# EAGLE design ESClogic2 (EAGLE 5.11)
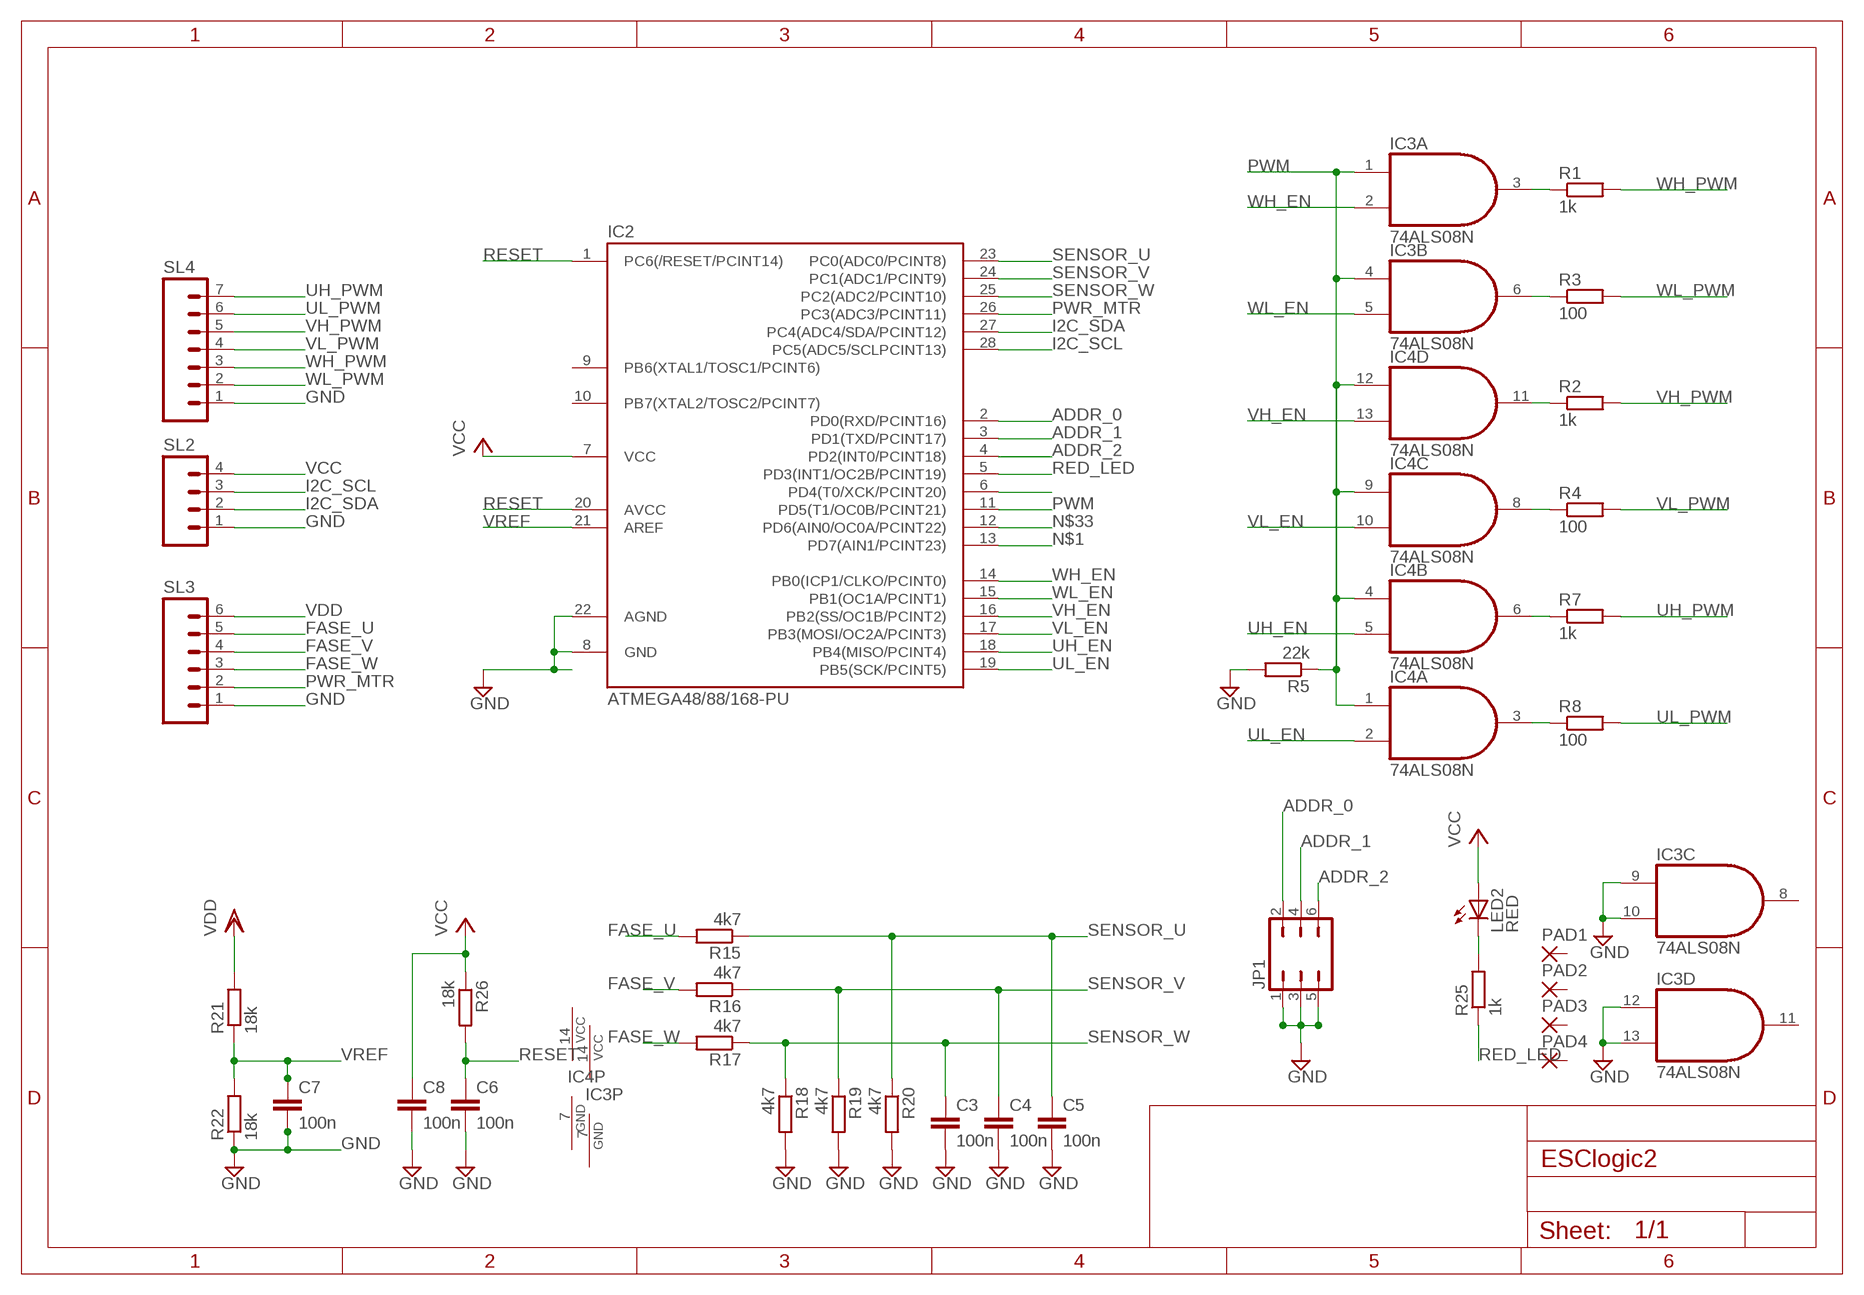
[diagram p0: schematic, sheet 1]

## Parts
C3  100n  C-EU050-025X075  [C050-025X075]
C4  100n  C-EU050-025X075  [C050-025X075]
C5  100n  C-EU050-025X075  [C050-025X075]
C6  100n  C-EU050-025X075  [C050-025X075]
C7  100n  C-EU050-025X075  [C050-025X075]
C8  100n  C-EU075-032X103  [C075-032X103]
IC2  ATMEGA48/88/168-PU  [DIL28-3]
IC3  74ALS08N  [DIL14]
IC4  74ALS08N  [DIL14]
JP1  JP3Q  [JP3Q]
LED2  RED  LED3MM  [LED3MM]
PAD1  2,54/1,0  [2,54/1,0]
PAD2  2,54/1,0  [2,54/1,0]
PAD3  2,54/1,0  [2,54/1,0]
PAD4  2,54/1,0  [2,54/1,0]
R1  1k  R-EU_0207/7  [0207/7]
R2  1k  R-EU_0207/7  [0207/7]
R3  100  R-EU_0207/7  [0207/7]
R4  100  R-EU_0207/7  [0207/7]
R5  22k  R-EU_0207/7  [0207/7]
R7  1k  R-EU_0207/7  [0207/7]
R8  100  R-EU_0207/7  [0207/7]
R15  4k7  R-EU_0207/7  [0207/7]
R16  4k7  R-EU_0207/7  [0207/7]
R17  4k7  R-EU_0207/7  [0207/7]
R18  4k7  R-EU_0207/7  [0207/7]
R19  4k7  R-EU_0207/7  [0207/7]
R20  4k7  R-EU_0207/7  [0207/7]
R21  18k  R-EU_0207/7  [0207/7]
R22  18k  R-EU_0207/7  [0207/7]
R25  1k  R-EU_0207/7  [0207/7]
R26  18k  R-EU_0207/7  [0207/7]
SL2  M04  [04P]
SL3  M06  [06P]
SL4  M07  [07P]

## Nets
ADDR_0: IC2.2(PD0(RXD/PCINT16)) JP1.2
ADDR_1: IC2.3(PD1(TXD/PCINT17)) JP1.4
ADDR_2: IC2.4(PD2(INT0/PCINT18)) JP1.6
FASE_U: R15.2 SL3.5
FASE_V: R16.2 SL3.4
FASE_W: R17.2 SL3.3
GND: C3.2 C4.2 C5.2 C6.2 C7.2 C8.2 IC2.8(GND) IC2.22(AGND) IC3.9(C:I0) IC3.10(C:I1) IC3.12(D:I0) IC3.13(D:I1) JP1.1 JP1.3 JP1.5 R5.2 R18.2 R19.2 R20.2 R22.1 SL2.1 SL3.1 SL4.1
I2C_SCL: IC2.28(PC5(ADC5/SCLPCINT13)) SL2.3
I2C_SDA: IC2.27(PC4(ADC4/SDA/PCINT12)) SL2.2
N$1: IC2.13(PD7(AIN1/PCINT23))
N$8: LED2.K(C) R25.2
N$12: IC3.3(A:O) R1.1
N$14: IC3.6(B:O) R3.1
N$15: IC4.11(D:O) R2.1
N$16: IC4.8(C:O) R4.1
N$17: IC4.6(B:O) R7.1
N$18: IC4.3(A:O) R8.1
N$31: IC2.6(PD4(T0/XCK/PCINT20))
N$33: IC2.12(PD6(AIN0/OC0A/PCINT22))
PWM: IC2.11(PD5(T1/OC0B/PCINT21)) IC3.1(A:I0) IC3.4(B:I0) IC4.1(A:I0) IC4.4(B:I0) IC4.9(C:I0) IC4.12(D:I0) R5.1
PWR_MTR: IC2.26(PC3(ADC3/PCINT11)) SL3.2
RED_LED: IC2.5(PD3(INT1/OC2B/PCINT19)) R25.1
RESET: C6.1 IC2.1(PC6(/RESET/PCINT14)) IC2.20(AVCC) R26.2
SENSOR_U: C5.1 IC2.23(PC0(ADC0/PCINT8)) R15.1 R20.1
SENSOR_V: C4.1 IC2.24(PC1(ADC1/PCINT9)) R16.1 R19.1
SENSOR_W: C3.1 IC2.25(PC2(ADC2/PCINT10)) R17.1 R18.1
UH_EN: IC2.18(PB4(MISO/PCINT4)) IC4.5(B:I1)
UH_PWM: R7.2 SL4.7
UL_EN: IC2.19(PB5(SCK/PCINT5)) IC4.2(A:I1)
UL_PWM: R8.2 SL4.6
VCC: C8.1 IC2.7(VCC) LED2.A R26.1 SL2.4
VDD: R21.2 SL3.6
VH_EN: IC2.16(PB2(SS/OC1B/PCINT2)) IC4.13(D:I1)
VH_PWM: R2.2 SL4.5
VL_EN: IC2.17(PB3(MOSI/OC2A/PCINT3)) IC4.10(C:I1)
VL_PWM: R4.2 SL4.4
VREF: C7.1 IC2.21(AREF) R21.1 R22.2
WH_EN: IC2.14(PB0(ICP1/CLKO/PCINT0)) IC3.2(A:I1)
WH_PWM: R1.2 SL4.3
WL_EN: IC2.15(PB1(OC1A/PCINT1)) IC3.5(B:I1)
WL_PWM: R3.2 SL4.2
Unconnected: IC2.9(PB6(XTAL1/TOSC1/PCINT6)) IC2.10(PB7(XTAL2/TOSC2/PCINT7)) IC3.8(C:O) IC3.11(D:O) PAD1.1(P) PAD2.1(P) PAD3.1(P) PAD4.1(P)

## Power pins joined to a net without a drawn wire
GND: IC3.7(P:GND) IC4.7(P:GND)
VCC: IC3.14(P:VCC) IC4.14(P:VCC)

## Library data of the parts
C3-C8 = rcl:C-EU: CAPACITOR, European symbol
IC2 = atmega8:ATMEGA48/88/168-PU
IC3 IC4 = 74xx-us:74*08: Quad 2-input AND gate
JP1 = jumper:JP3Q: JUMPER
LED2 = led:LED: LED OSRAM: - CHIPLED LG R971, LG N971, LY N971, LG Q971, LY Q971, LO R971, LY R971 LH N974, LH R974 LS Q976, LO Q976, LY Q976 LO Q996 - Hyper CHIPLED LW Q18S LB Q993, LB Q99A, LB R99A - SideLED LS A670, LO A670, LY A670, LG A670, LP A670 LB A673, LV A673, LT A673, LW A673 LH A674 LY A675 LS A676, LA A676, LO A676, LY A676, LW A676 LS A679, LY A679, LG A679 - Hyper Micro SIDELED® LS Y876, LA Y876, LO Y876, LY Y876 LT Y87S - SmartLED LW L88C, LW L88S LB L89C, LB L89S, LG L890 LS L89K, LO L89K, LY L89K LS L896, LA L896, LO L896, LY L896 - TOPLED LS T670, LO T670, LY T670, LG T670, LP T670 LSG T670, LSP T670, LSY T670, LOP T670, LYG T670 LG T671, LOG T671, LSG T671 LB T673, LV T673, LT T673, LW T673 LH T674 LS T676, LA T676, LO T676, LY T676, LB T676, LH T676, LSB T676, LW T676 LB T67C, LV T67C, LT T67C, LS T67K, LO T67K, LY T67K, LW E67C LS E67B, LA E67B, LO E67B, LY E67B, LB E67C, LV E67C, LT E67C LW T67C LS T679, LY T679, LG T679 LS T770, LO T770, LY T770, LG T770, LP T770 LB T773, LV T773, LT T773, LW T773 LH T774 LS E675, LA E675, LY E675, LS T675 LS T776, LA T776, LO T776, LY T776, LB T776 LHGB T686 LT T68C, LB T68C - Hyper Mini TOPLED® LB M676 - Mini TOPLED Santana® LG M470 LS M47K, LO M47K, LY M47K Source: http://www.osram.convergy.de LUXEON: - LUMILED® LXK2-PW12-R00, LXK2-PW12-S00, LXK2-PW14-U00, LXK2-PW14-V00 LXK2-PM12-R00, LXK2-PM12-S00, LXK2-PM14-U00 LXK2-PE12-Q00, LXK2-PE12-R00, LXK2-PE12-S00, LXK2-PE14-T00, LXK2-PE14-U00 LXK2-PB12-K00, LXK2-PB12-L00, LXK2-PB12-M00, LXK2-PB14-N00, LXK2-PB14-P00, LXK2-PB14-Q00 LXK2-PR12-L00, LXK2-PR12-M00, LXK2-PR14-Q00, LXK2-PR14-R00 LXK2-PD12-Q00, LXK2-PD12-R00, LXK2-PD12-S00 LXK2-PH12-R00, LXK2-PH12-S00 LXK2-PL12-P00, LXK2-PL12-Q00, LXK2-PL12-R00 Source: www.luxeon.com KINGBRIGHT: KA-3528ASYC Source: www.kingbright.com
PAD1-PAD4 = wirepad:2,54/1,0: THROUGH-HOLE PAD
R1-R5 R7 R8 R15-R22 R25 R26 = rcl:R-EU_: RESISTOR, European symbol
SL2 = con-amp-quick:M04: AMP QUICK CONNECTOR; OC_FARNELL: unknown; OC_NEWARK: unknown
SL3 = con-amp-quick:M06: AMP QUICK CONNECTOR; OC_FARNELL: unknown; OC_NEWARK: unknown
SL4 = con-amp-quick:M07: AMP QUICK CONNECTOR; OC_FARNELL: unknown; OC_NEWARK: unknown

## Board
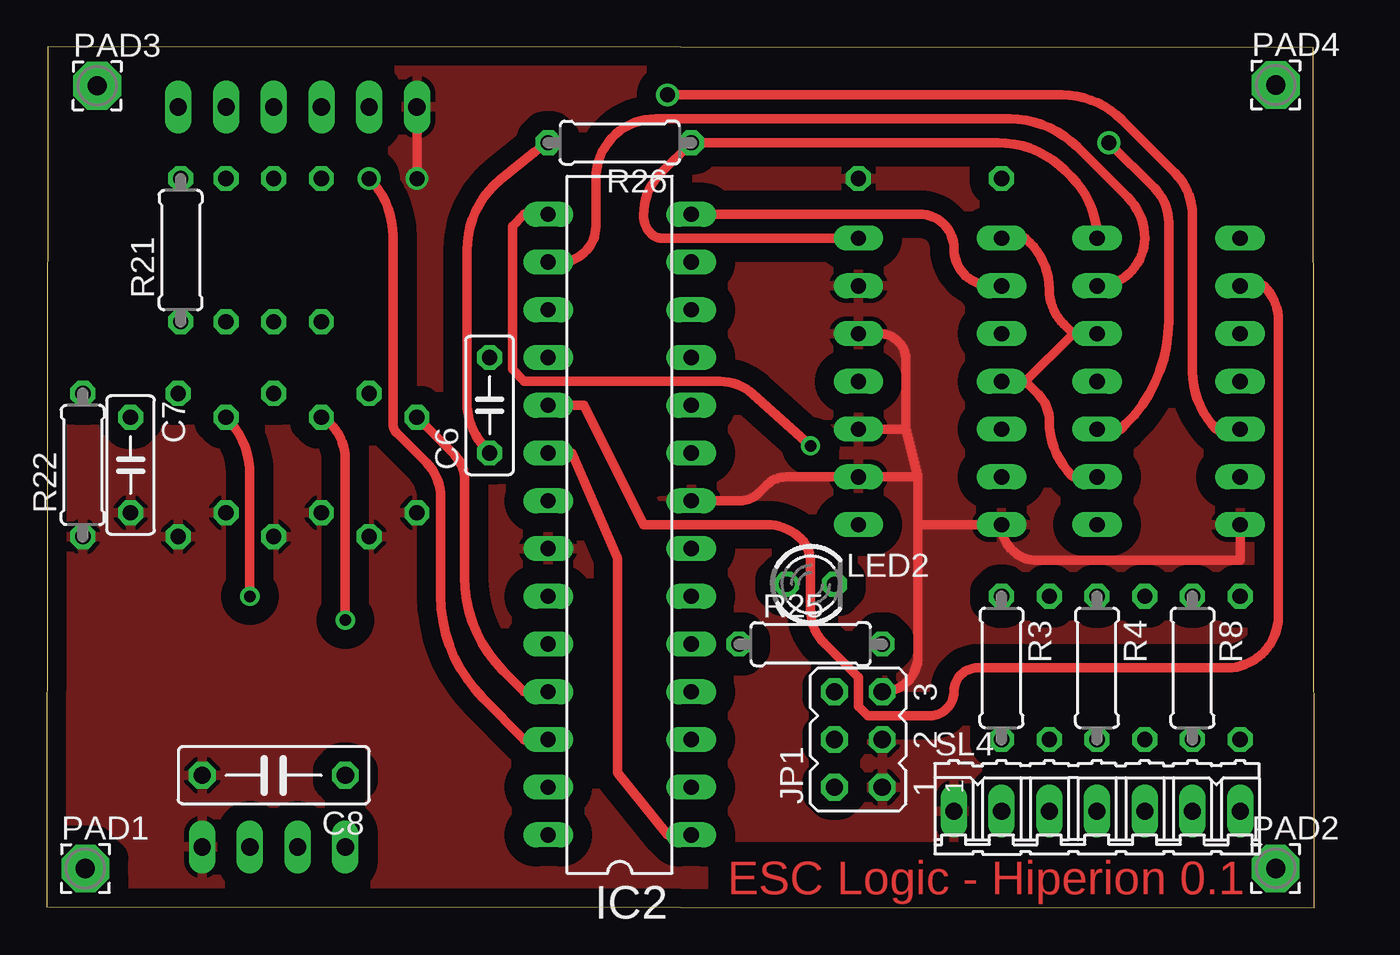
[diagram p1: board, top side]
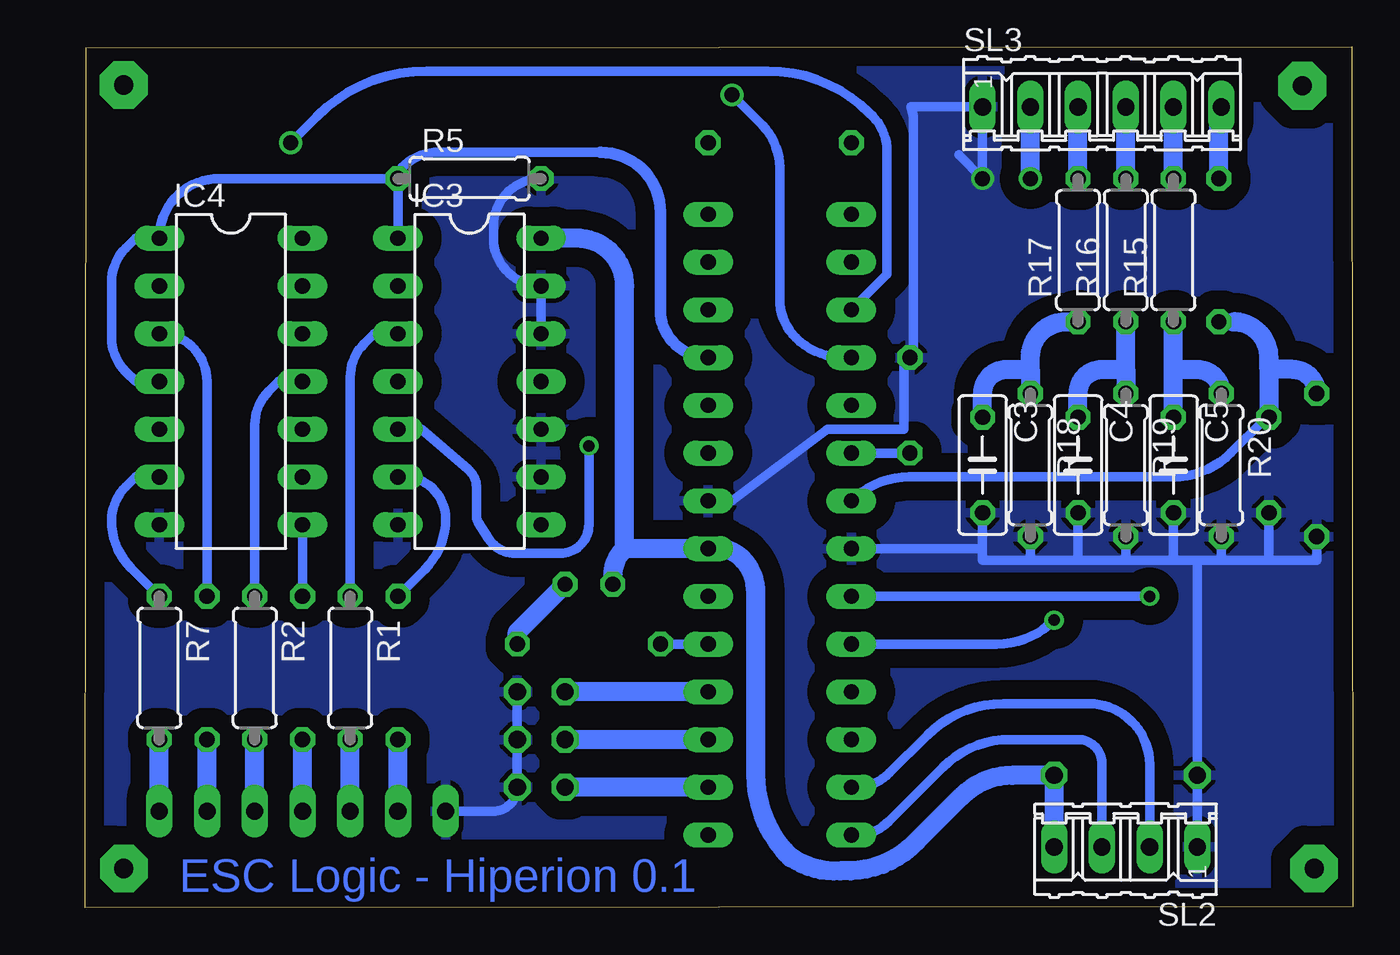
[diagram p2: board, bottom side, seen from below]

Size 67.45 x 45.79 mm. Coordinates in mm from the lower left corner, seen from the top.
Outline: 0,0.05 67.45,0 67.41,45.75 0.03,45.79 0,0.05
Copper layers (1*16): Top 0.035mm / dielectric 1.5mm / Bottom 0.035mm
Design rules "default *": minimum track width 20mil, minimum drill 24mil, track to track 8mil, track to pad 8mil, pad to pad 8mil, via to via 8mil, smd to smd 8mil, copper to edge 40mil, drill to drill 8mil, minimum pad ring 10mil, minimum via ring 8mil, stop-mask expansion 4mil, vias tented up to drill 0mil, thermal gap 10mil

### Footprints (pad centres in the part's own frame; a part is rotated, then mirrored left to right if it is on the bottom)
C050-025X075 = drill 0.813 octagon: 1 -2.54,0; 2 2.54,0
C075-032X103 = drill 0.914 octagon: 1 -3.81,0; 2 3.81,0
DIL28-3 = drill 0.813 long: 1 -16.51,-3.81; 2 -13.97,-3.81; 3 -11.43,-3.81; 4 -8.89,-3.81; 5 -6.35,-3.81; 6 -3.81,-3.81; 7 -1.27,-3.81; 8 1.27,-3.81; 9 3.81,-3.81; 10 6.35,-3.81; 11 8.89,-3.81; 12 11.43,-3.81; 13 13.97,-3.81; 14 16.51,-3.81; 15 16.51,3.81; 16 13.97,3.81; 17 11.43,3.81; 18 8.89,3.81; 19 6.35,3.81; 20 3.81,3.81; 21 1.27,3.81; 22 -1.27,3.81; 23 -3.81,3.81; 24 -6.35,3.81; 25 -8.89,3.81; 26 -11.43,3.81; 27 -13.97,3.81; 28 -16.51,3.81
DIL14 = drill 0.813 long: 1 -7.62,-3.81; 2 -5.08,-3.81; 3 -2.54,-3.81; 4 0,-3.81; 5 2.54,-3.81; 6 5.08,-3.81; 7 7.62,-3.81; 8 7.62,3.81; 9 5.08,3.81; 10 2.54,3.81; 11 0,3.81; 12 -2.54,3.81; 13 -5.08,3.81; 14 -7.62,3.81
JP3Q = drill 0.914 octagon: 1 -2.54,-1.27; 2 -2.54,1.27; 3 0,-1.27; 4 0,1.27; 5 2.54,-1.27; 6 2.54,1.27
LED3MM = drill 0.813 octagon: A -1.27,0; K 1.27,0
2,54/1,0 = drill 1.016 pad 2.54 octagon: 1 0,0
0207/7 = drill 0.813 octagon: 1 -3.81,0; 2 3.81,0
04P = drill 0.914 long: 1 -3.81,0; 2 -1.27,0; 3 1.27,0; 4 3.81,0
06P = drill 0.914 long: 1 -6.35,0; 2 -3.81,0; 3 -1.27,0; 4 1.27,0; 5 3.81,0; 6 6.35,0
07P = drill 0.914 long: 1 -7.62,0; 2 -5.08,0; 3 -2.54,0; 4 0,0; 5 2.54,0; 6 5.08,0; 7 7.62,0

### Placement (x,y rotation side)
C3  19.69,23.55 270 bottom
C4  14.61,23.55 270 bottom
C5  9.53,23.55 270 bottom
C6  23.56,26.72 90 top
C7  4.45,23.55 270 top
C8  12.07,7.04 180 top
IC2  30.48,20.37 90 top
IC3  46.99,27.99 270 bottom
IC4  59.69,27.99 270 bottom
JP1  43.18,8.94 90 top
LED2  40.64,17.2 0 top
PAD1  2.04,2.08 0 top
PAD2  65.39,2.08 0 top
PAD3  2.68,43.72 0 top
PAD4  65.4,43.76 0 top
R1  53.34,12.75 270 bottom
R2  58.42,12.75 270 bottom
R3  50.8,12.75 270 top
R4  55.88,12.75 270 top
R5  46.99,38.79 0 bottom
R7  63.5,12.75 270 bottom
R8  60.96,12.75 270 top
R15  9.53,34.98 90 bottom
R16  12.07,34.98 90 bottom
R17  14.61,34.98 90 bottom
R18  17.15,23.55 270 bottom
R19  12.07,23.55 270 bottom
R20  6.99,23.55 270 bottom
R21  7.12,34.98 90 top
R22  1.91,23.55 90 top
R25  40.64,14.02 0 top
R26  30.48,40.69 180 top
SL2  12.07,3.23 180 bottom
SL3  13.34,42.6 0 bottom
SL4  55.88,5.13 0 top

### Tracks (layer width: path | path; a pad name or v marks a point on that pad's centre or on a via)
ADDR_0
  Bottom 1.016: IC2.2 JP1.2
ADDR_1
  Bottom 1.016: IC2.3 JP1.4
ADDR_2
  Bottom 1.016: IC2.4 JP1.6
FASE_U
  Bottom 1.016: R15.2 SL3.5
FASE_V
  Bottom 1.016: R16.2 SL3.4
FASE_W
  Bottom 1.016: R17.2 SL3.3
GND  (via drill 0.8)
  Top 0.508: IC4.7 63.5,18.47 52.71,18.47 arc-90 IC3.7 46.36,20.37 | 46.36,20.37 46.36,22.91 | 46.36,22.91 45.72,25.45 | 45.72,25.45 45.72,29.11 arc90 44.3,30.53 IC3.12 | IC2.8 36.88,21.64 arc45 37.88,22.06 38.32,22.5 arc-45 39.33,22.91 IC3.9 46.36,22.91 | JP1.5 arc90 46.36,13.39 46.36,20.37 | 45.72,25.45 IC3.10 | SL3.1 v19.69,38.79
  Bottom 0.508: IC3.12 IC3.13 arc90 45.72,35.61 45.72,36.25 arc90 R5.2 | SL4.1 45.72,5.13 arc-90 JP1.1 JP1.3 JP1.5 | R22.1 1.91,18.47 4.45,18.47 | 6.99,18.47 4.45,18.47 | 8.26,18.47 6.99,18.47 | 8.26,18.47 9.53,18.47 | 9.53,18.47 12.07,18.47 | 12.07,18.47 14.61,18.47 | 14.61,18.47 17.15,18.47 | 17.15,18.47 R18.2 | 12.07,18.47 R19.2 | 6.99,18.47 R20.2 | 4.45,18.47 C7.2 | 9.53,18.47 C5.2 | 14.61,18.47 C4.2 | 19.69,19.1 19.69,18.47 17.15,18.47 | 19.69,19.1 C3.2 | 19.69,19.1 IC2.22 | SL2.1 C8.2 8.26,18.47 | IC2.8 33.02,21.64 27.94,25.45 23.88,25.45 23.88,29.01 C6.2 23.37,29.52 23.37,41.58 23.37,42.09 23.5,42.6 SL3.1 v19.69,38.79 20.96,40.06
  pour Top (isolate 1.016): -1.27,-1.22 -0.63,47.04 69.22,47.04 69.22,-1.22
  pour Bottom (isolate 1.016): -1.9,47.68 69.85,47.68 69.85,-1.85 -1.9,-1.85
I2C_SCL
  Bottom 0.508: SL2.3 13.34,7.67 arc-90 14.61,8.94 18.22,8.94 arc-45 21.81,7.45 24.66,4.61 arc45 26.46,3.86 IC2.28
I2C_SDA
  Bottom 0.508: SL2.2 10.8,7.63 arc-45 11.73,9.87 11.77,9.92 arc-45 14.02,10.85 18.59,10.85 arc-45 22.63,9.17 24.64,7.17 arc45 26.49,6.4 IC2.27
N$8
  Bottom 1.016: R25.2 44.45,14.66 LED2.K
N$12
  Bottom 0.508: R1.1 53.34,28.21 arc45 52.6,30.01 52.07,30.53 IC3.3
N$14
  Bottom 0.508: R3.1 49.38,17.99 arc-45 48.26,20.68 arc-90 50.5,22.91 IC3.6
N$15
  Bottom 0.508: R2.1 58.42,25.67 arc45 57.68,27.47 57.15,27.99 IC4.11
N$16
  Bottom 0.508: R4.1 IC4.8
N$17
  Bottom 0.508: R7.1 64.99,18.05 arc45 66.04,20.59 arc45 65.3,22.39 64.77,22.91 IC4.6
N$18
  Bottom 0.508: R8.1 60.96,27.99 arc-90 IC4.3
PWM
  Top 0.508: 52.07,27.99 52.76,27.31 arc-45 53.34,25.89 arc45 54.55,22.97 54.61,22.91 IC4.9 | IC3.1 52.07,35.61 52.31,35.37 arc-45 53.34,32.89 arc45 54.11,31.04 54.61,30.53 | 52.07,27.99 IC3.4 | 54.61,30.53 52.07,27.99 | 54.61,30.53 IC4.12
  Bottom 0.508: IC4.4 64.77,27.99 65.3,28.52 arc45 66.04,30.31 66.04,33.29 arc45 65.3,35.09 64.77,35.61 IC4.1 arc90 60.33,38.79 R5.1 | R5.1 IC3.1 | 40.02,40.18 48.63,40.18 arc-45 50.61,39.37 50.8,39.17 R5.1
  Bottom 0.61: IC2.11 arc90 36.83,31.8 36.83,37 arc-90 40.02,40.18
PWR_MTR  (via drill 0.8)
  Top 0.508: IC2.26 25.4,8.94 23.21,11.14 arc-45 20.96,16.57 20.96,21.83 arc45 20.19,23.68 18.61,25.27 arc-45 18.42,25.72 18.42,35.72 arc45 v17.15,38.79
  Bottom 1.016: v17.15,38.79 SL3.2
RED_LED
  Bottom 0.508: IC2.5 R25.1
RESET
  Top 0.508: IC2.1 33.02,3.86 30.36,7.16 30.36,18.59 27.94,24.18 IC2.20 | R26.2 25.91,40.18 24.12,38.71 arc51 22.36,34.98 22.36,26.89 arc45 23.37,24.44 C6.1
  Bottom 0.508: IC2.20 C6.1 | C6.1 23.5,24.18 | C6.1
SENSOR_U  (via drill 0.61)
  Top 0.508: v10.8,16.56 10.8,23.02 arc45 C5.1
  Bottom 0.508: v10.8,16.56 IC2.23
  Bottom 1.016: 9.53,28.63 8.26,28.63 arc90 R20.1 | C5.1 9.53,28.63 | 9.53,28.63 R15.1
SENSOR_V  (via drill 0.61)
  Top 0.508: v15.88,15.29 15.88,23.84 arc45 15.1,25.73 14.86,25.96 C4.1
  Bottom 0.508: v15.88,15.29 arc45 18.95,14.02 IC2.24
  Bottom 1.016: 12.07,28.63 R16.1 | 12.07,28.63 R19.1 | C4.1 14.61,27.36 arc90 13.34,28.63 12.07,28.63
SENSOR_W
  Top 0.508: C3.1 21.67,24.11 arc-45 22.23,22.76 22.23,17.56 arc45 24.28,12.6 25.4,11.48 IC2.25
  Bottom 1.016: 17.15,28.63 R18.1 | 17.15,28.63 17.15,29.26 arc90 15.24,31.17 R17.1 | C3.1 19.69,27.36 arc90 18.42,28.63 17.15,28.63
UH_EN  (via drill 0.8)
  Top 0.508: IC4.5 62.23,25.45 arc-45 60.96,28.52 60.96,36.84 arc45 60.03,39.08 57.2,41.92 arc45 54.02,43.23 v33.02,43.23
  Bottom 0.508: IC2.18 27.09,29.26 arc45 29.63,30.31 arc45 30.48,32.37 30.48,39.38 arc-45 31.41,41.62 v33.02,43.23
UH_PWM
  Bottom 1.016: SL4.7 R7.2
UL_EN
  Top 0.508: IC4.2 64.77,33.07 arc-45 65.54,31.23 65.54,15.49 arc-90 62.79,12.75 49.53,12.75 arc90 48.26,11.48 arc-90 46.99,10.21 43.69,10.21 43.22,10.68 arc-45 43.18,10.77 43.18,12.24 41.35,14.08 arc-45 40.64,15.78 40.64,18.36 arc45 40.12,19.63 arc45 38.32,20.37 31.75,20.37 28.58,26.72 IC2.19
UL_PWM
  Bottom 1.016: SL4.6 R8.2
VCC
  Top 0.508: IC3.14 32.7,35.61 arc-45 32.17,35.83 arc-45 31.75,36.84 arc-45 32.68,39.08 R26.1 50.6,40.69 arc-45 54.2,39.2 54.54,38.86 arc-45 IC4.14
  Bottom 0.508: 38.74,19.1 38.82,19.03 | 30.14,2.89 29.89,2.64
  Bottom 1.016: 38.82,19.03 arc-45 39.37,17.68 LED2.A | IC3.14 41.28,35.61 arc90 38.74,33.07 38.74,19.1 IC2.7 33.77,19.1 arc45 32.5,18.58 arc45 31.75,16.78 31.75,7.13 arc-45 29.89,2.64 | SL2.4 C8.1 18.11,7.04 arc-45 20.8,5.92 23.2,3.52 arc45 26.72,1.96 27.26,1.96 arc45 30.14,2.89
VDD
  Bottom 0.508: 7.12,42.6 SL3.6
  Bottom 1.016: R21.2 7.12,42.6
VH_EN
  Top 0.508: IC4.13 arc90 58.42,35.61 arc45 57.53,37.78 54.83,40.47 arc45 51.24,41.96 32.39,41.96 arc90 29.21,38.79 29.21,36.25 arc-90 27.31,34.34 IC2.16
VH_PWM
  Bottom 1.016: SL4.5 R2.2
VL_EN  (via drill 0.8)
  Top 0.508: IC4.10 57.15,25.45 57.43,25.73 arc45 59.69,31.19 59.69,36.47 arc45 58.95,38.26 v56.52,40.69
  Bottom 0.508: v56.52,40.69 55.13,42.08 arc45 49.29,44.5 31.1,44.5 arc45 25.71,42.27 25.54,42.09 arc45 24.77,40.24 24.77,33.71 IC2.17
VL_PWM
  Bottom 1.016: SL4.4 R4.2
VREF
  Bottom 0.508: 6.35,31.17 R21.1 | IC2.21 arc45 23.61,22.91 9.56,22.91 arc-45 6.47,24.19 4.7,25.96 C7.1
  Bottom 1.016: R22.2 arc-90 3.18,28.63 4.45,28.63 | 4.45,28.63 C7.1 | 4.45,28.63 4.45,29.26 arc-90 6.35,31.17
WH_EN
  Top 0.508: IC2.14 46.46,36.88 arc-90 48.26,35.08 arc90 50.27,33.07 IC3.2 51.44,33.07
WH_PWM
  Bottom 1.016: SL4.3 R1.2
WL_EN  (via drill 0.61)
  Top 0.508: v40.64,24.56 37.58,27.32 arc42 35.83,27.99 25.4,27.99 24.77,28.63 24.77,36.25 25.4,36.88 IC2.15
  Bottom 0.508: v40.64,24.56 40.64,20.37 arc90 42.17,18.85 44.54,18.85 arc57 45.97,19.63 46.54,20.51 arc33 46.61,20.76 46.61,22.31 arc-49 47.07,23.31 49.53,25.45 IC3.5
WL_PWM
  Bottom 1.016: SL4.2 R3.2

### Text on the board
Top: ESC Logic - Hiperion 0.1
Bottom: ESC Logic - Hiperion 0.1